# Altium schematic sheet sb-sonata-usbhub.SchDoc: USB Hub
size Letter; Organization: NewAE Technology Inc.; Address1: 1083 Queen St., Suite 196; Address2: Halifax; Address3: NS; Address4: Canada B3H 0B2; SheetNumber: 3; SheetTotal: 20; SheetApproved: YES
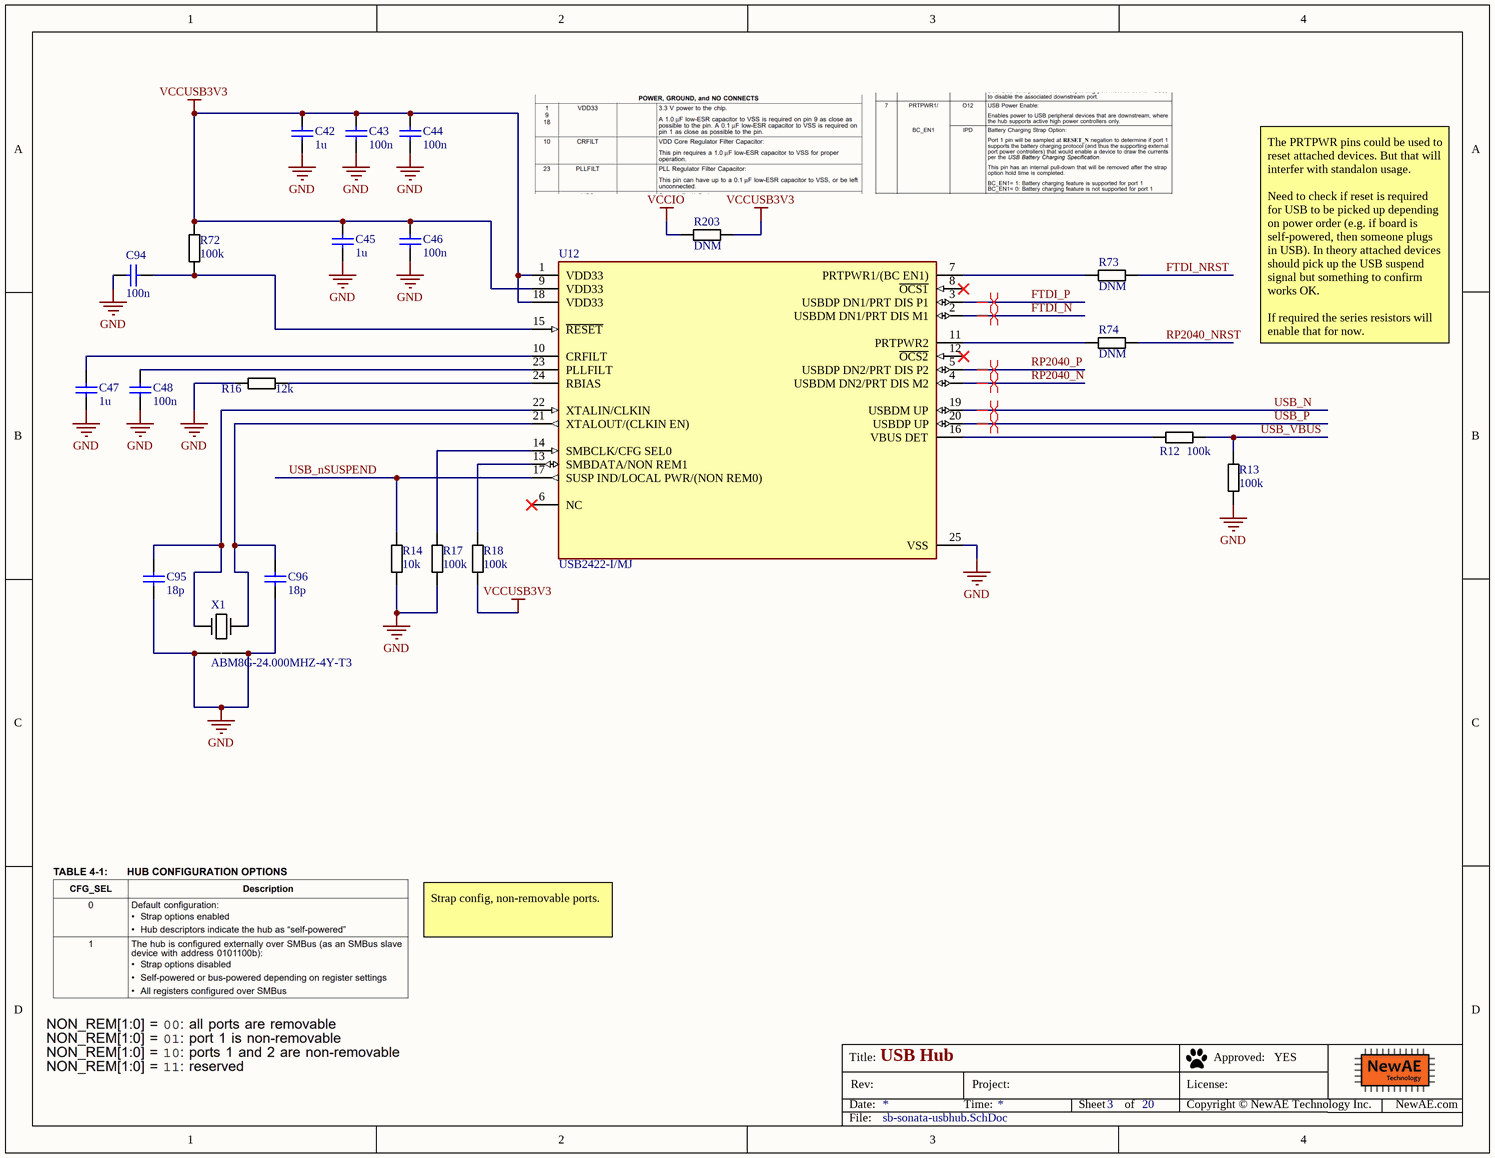
[diagram p0: sb-sonata-usbhub.SchDoc]

## Parts
C42  1u  [CAPC0603_M]
C43  100n  [CAPC0402_M]
C44  100n  [CAPC0402_M]
C45  1u  [CAPC0603_M]
C46  100n  [CAPC0402_M]
C47  1u  [CAPC0603_M]
C48  100n  [CAPC0402_M]
C94  100n  [CAPC0402_M]
C95  18p  [CAPC0402_M]
C96  18p  [CAPC0402_M]
R12  100k  [RESC1005X40N]
R13  100k  [RESC1005X40N]
R14  10k  [RESC1005X40N]
R16  12k  [RESC1005X40N]
R17  100k  [RESC1608X55N]
R18  100k  [RESC1608X55N]
R72  100k  [RESC1608X55N]
R73  DNM  [RESC1005X40N]
R74  DNM  [RESC1005X40N]
R203  DNM  [RESC1005X40N]
U12  USB2422-I/MJ  [FP-24-S4QFN-4x4B-0_5P-MFG]
X1  ABM8G-24.000MHZ-4Y-T3  [ABM8G]

## Nets
GND: C42.2 C43.2 C44.2 C45.2 C46.2 C47.2 C48.2 C94.2 C95.2 C96.2 R13.2 R14.2 R16.2 R17.1 U12.25(VSS) X1.2(GND) X1.4(GND)
VCCIO: R203.1
VCCUSB3V3: C42.1 C43.1 C44.1 C45.1 C46.1 R18.1 R72.2 R203.2 U12.1(VDD33) U12.9(VDD33) U12.18(VDD33)
FTDI_N: U12.2(USBDM_DN1/PRT_DIS_M1)
FTDI_NRST: R73.2
FTDI_P: U12.3(USBDP_DN1/PRT_DIS_P1)
RP2040_N: U12.4(USBDM_DN2/PRT_DIS_M2)
RP2040_NRST: R74.2
RP2040_P: U12.5(USBDP_DN2/PRT_DIS_P2)
USB_N: U12.19(USBDM_UP)
USB_nSUSPEND: R14.1 U12.17(SUSP_IND/LOCAL_PWR/(NON_REM0))
USB_P: U12.20(USBDP_UP)
USB_VBUS: R12.2 R13.1
NetC47_1: C47.1 U12.10(CRFILT)
NetC48_1: C48.1 U12.23(PLLFILT)
NetC94_1: C94.1 R72.1 U12.15(~{RESET})
NetC95_1: C95.1 U12.22(XTALIN/CLKIN) X1.3(OUT)
NetC96_1: C96.1 U12.21(XTALOUT/(CLKIN_EN)) X1.1(IN)
NetR12_1: R12.1 U12.16(VBUS_DET)
NetR16_1: R16.1 U12.24(RBIAS)
NetR17_2: R17.2 U12.14(SMBCLK/CFG_SEL0)
NetR18_2: R18.2 U12.13(SMBDATA/NON_REM1)
NetR73_1: R73.1 U12.7(PRTPWR1/(BC_EN1))
NetR74_1: R74.1 U12.11(PRTPWR2)

Not connected (* = marked no-connect by the designer): U12 6(NC)* 8(~{OCS1})* 12(~{OCS2})*

## Layout directives
differential pair; differential pair class USB_DIFF_PAIR: FTDI_N, FTDI_P, RP2040_N, RP2040_P, USB_N, USB_P

## Notes on the sheet
- The PRTPWR pins could be used to reset attached devices. But that will interfer with standalon usage.
  Need to check if reset is required for USB to be picked up depending on power order (e.g. if board is self-powered, then someone plugs in USB). In theory attached devices should pick up the USB suspend signal but something to confirm works OK.
  If required the series resistors will enable that for now.
- Strap config, non-removable ports.
- Title:
- Date:
- Rev:
- Time:
- Project:
- Sheet
- of
- License:
- Copyright © NewAE Technology Inc.
- Approved:
- NewAE.com
- File:

## Library data of the parts
C42 C45 C47 = CCHIP-1u-0603: 1u, 0603, 50V; Manufacture Part Number 1: CL10A105KB8NNNC; Component Group: Capacitor; Case-EIA: 0603; Case-Metric: 1608; Rated Voltage: 50VDC; Part Number: CCHIP-1u-0603; Footprint: 0603; Pin Count: 2; Supplier 1: Digi-Key; Supplier Part Number 1: 1276-1860-1-ND; Value: 1u; Mounting Technology: SMT; Component Kind: Standard; Component Type: Standard
C43 C44 C46 C48 C94 = CCHIP-100n-0402: 100n, 0402; Manufacture Part Number 1: CGA2B3X7R1V104K050BB; Component Group: Capacitor; Case-EIA: 0402; Part Number: CCHIP-100n-0402; Footprint: 0402; Pin Count: 2; Supplier 1: Digi-Key; Supplier Part Number 1: 445-6901-1-ND; Value: 100n; Mounting Technology: SMT; Component Kind: Standard; Component Type: Standard
C95 C96 = CCHIP-18p-0402: 18p, 0402; Manufacture Part Number 1: GRM1555C1H180JA01D; Component Group: Capacitor; Case-EIA: 0402; Part Number: CCHIP-18p-0402; Footprint: 0402; Pin Count: 2; Supplier 1: Digi-Key; Supplier Part Number 1: 490-5858-1-ND; Value: 18p; Mounting Technology: SMT; Component Kind: Standard; Component Type: Standard
R12 R13 = RCHIP-100K-0402: 100k res, 0402, 1%, 1/16W; Manufacture 1: Yageo; Manufacture Part Number 1: RC0402FR-07100KL; Component Group: Resistor; Case-EIA: 0402; Case-Metric: 1005; Rated Power: 0.063W; Rated Voltage: 75VDC; Part Number: RCHIP-100K-0402; Footprint: 0402; Pin Count: 2; Supplier 1: Digi-Key; Supplier Part Number 1: 311-100KLRCT-ND; Value: 100k; Tolerance: 1%; Mounting Technology: SMT; Temperature Range: -55C to 155C; Component Kind: Standard; Component Type: Standard
R14 = RCHIP-10K-0402: 10k res, 0402, 1%, 1/16W; Manufacture 1: Yageo; Manufacture Part Number 1: RC0402FR-0710KL; Component Group: Resistor; Case-EIA: 0402; Case-Metric: 1005; Rated Power: 0.063W; Rated Voltage: 75VDC; Part Number: RCHIP-10K-0402; Footprint: 0402; Pin Count: 2; Supplier 1: Digi-Key; Supplier Part Number 1: 311-10.0KLRCT-ND; Value: 10k; Tolerance: 1%; Mounting Technology: SMT; Temperature Range: -55C to 155C; Component Kind: Standard; Component Type: Standard
R16 = RCHIP-12K-0402: 12k res, 0402, 1%, 1/16W; Manufacture 1: Yageo; Manufacture Part Number 1: RC0402FR-0712KL; Component Group: Resistor; Case-EIA: 0402; Case-Metric: 1005; Rated Power: 0.063W; Rated Voltage: 75VDC; Part Number: RCHIP-12K-0402; Footprint: 0402; Pin Count: 2; Supplier 1: Digi-Key; Supplier Part Number 1: 311-12.0KLRCT-ND; Value: 12k; Tolerance: 1%; Mounting Technology: SMT; Temperature Range: -55C to 155C; Component Kind: Standard; Component Type: Standard
R17 R18 R72 = RCHIP-100K-0603: 100k res, 0603, 1%, 1/10W; Manufacture 1: Yageo; Manufacture Part Number 1: RC0603FR-07100KL; Component Group: Resistor; Case-EIA: 0603; Case-Metric: 1608; Rated Power: 0.1W; Rated Voltage: 75VDC; Part Number: RCHIP-100K-0603; Footprint: 0603; Pin Count: 2; Supplier 1: Digi-Key; Supplier Part Number 1: 311-100KHRCT-ND; Value: 100k; Tolerance: 1%; Mounting Technology: SMT; Temperature Range: -55C to 155C; Component Kind: Standard; Component Type: Standard
R73 R74 R203 = RCHIP-DNM-0402: Component Group: Resistor; Case-EIA: 0402; Case-Metric: 1005; Part Number: RCHIP-DNM-0402; Footprint: 0402; Pin Count: 2; Value: DNM; Component Kind: Standard; Component Type: Standard
U12 = CMP-06284-000010-1: IC HUB CTLR USB 2.0 24QFN; Manufacturer: Microchip; Min Supply Voltage: 3V; Standoff Height: 0mm; Usb Standard: USB 2.0; Interface: I2C,USB,SMBus; Number Of Ports: 2; Max Supply Voltage: 3.6V; Nominal Supply Current: 29-70mA; Device Class L1: Integrated Circuits (ICs); ComponentLink2URL: http://ww1.microchip.com/downloads/en/DeviceDoc/00001726B.pdf; Temperature: -40°C to +85°C; Lead Free: Yes; Category: IC; RoHS: TRUE; Digikey Description: IC HUB CTLR USB 2.0 24QFN; Device Class L2: Interface ICs; Height: 1mm; Device Class L3: USB Interface ICs; Temperature Range High: +85°C; Automotive: No; Ipc Land Pattern Name: QFN50P400X400X90-24; Temperature Range Low: -40°C; Manufacturer Part Number: USB2422-I/MJ; Mouser Description: Microchip USB2422-I/MJ; USB Controller; USB 2.0; 3 - 3.6 V; 24-Pin SQFN; Package: 24-S4QFN-4x4B-0.5P; Ambient Temperature Range Low: -40°C; ComponentLink2Description: Datasheet; Ambient Temperature Range High: +85°C; Octopart: https://octopart.com/usb2422-i%2Fmj-microchip-29030614
X1 = ABM8G-24.000MHZ-4Y-T3: CRYSTAL 24.0000MHZ 10PF SMD; Manufacture 1: Abracon LLC; Part Number: ABM8G-24.000MHZ-4Y-T3; Component Group: Crystal; Manufacture Part Number 1: ABM8G-24.000MHZ-4Y-T3; Pin Count: 4; Supplier 1: Digi-Key; Supplier Part Number 1: 535-10913-1-ND; Value: 24.000MHz; Component Kind: Standard; Component Type: Standard